# EAGLE design full_adder (EAGLE 6.5.0)
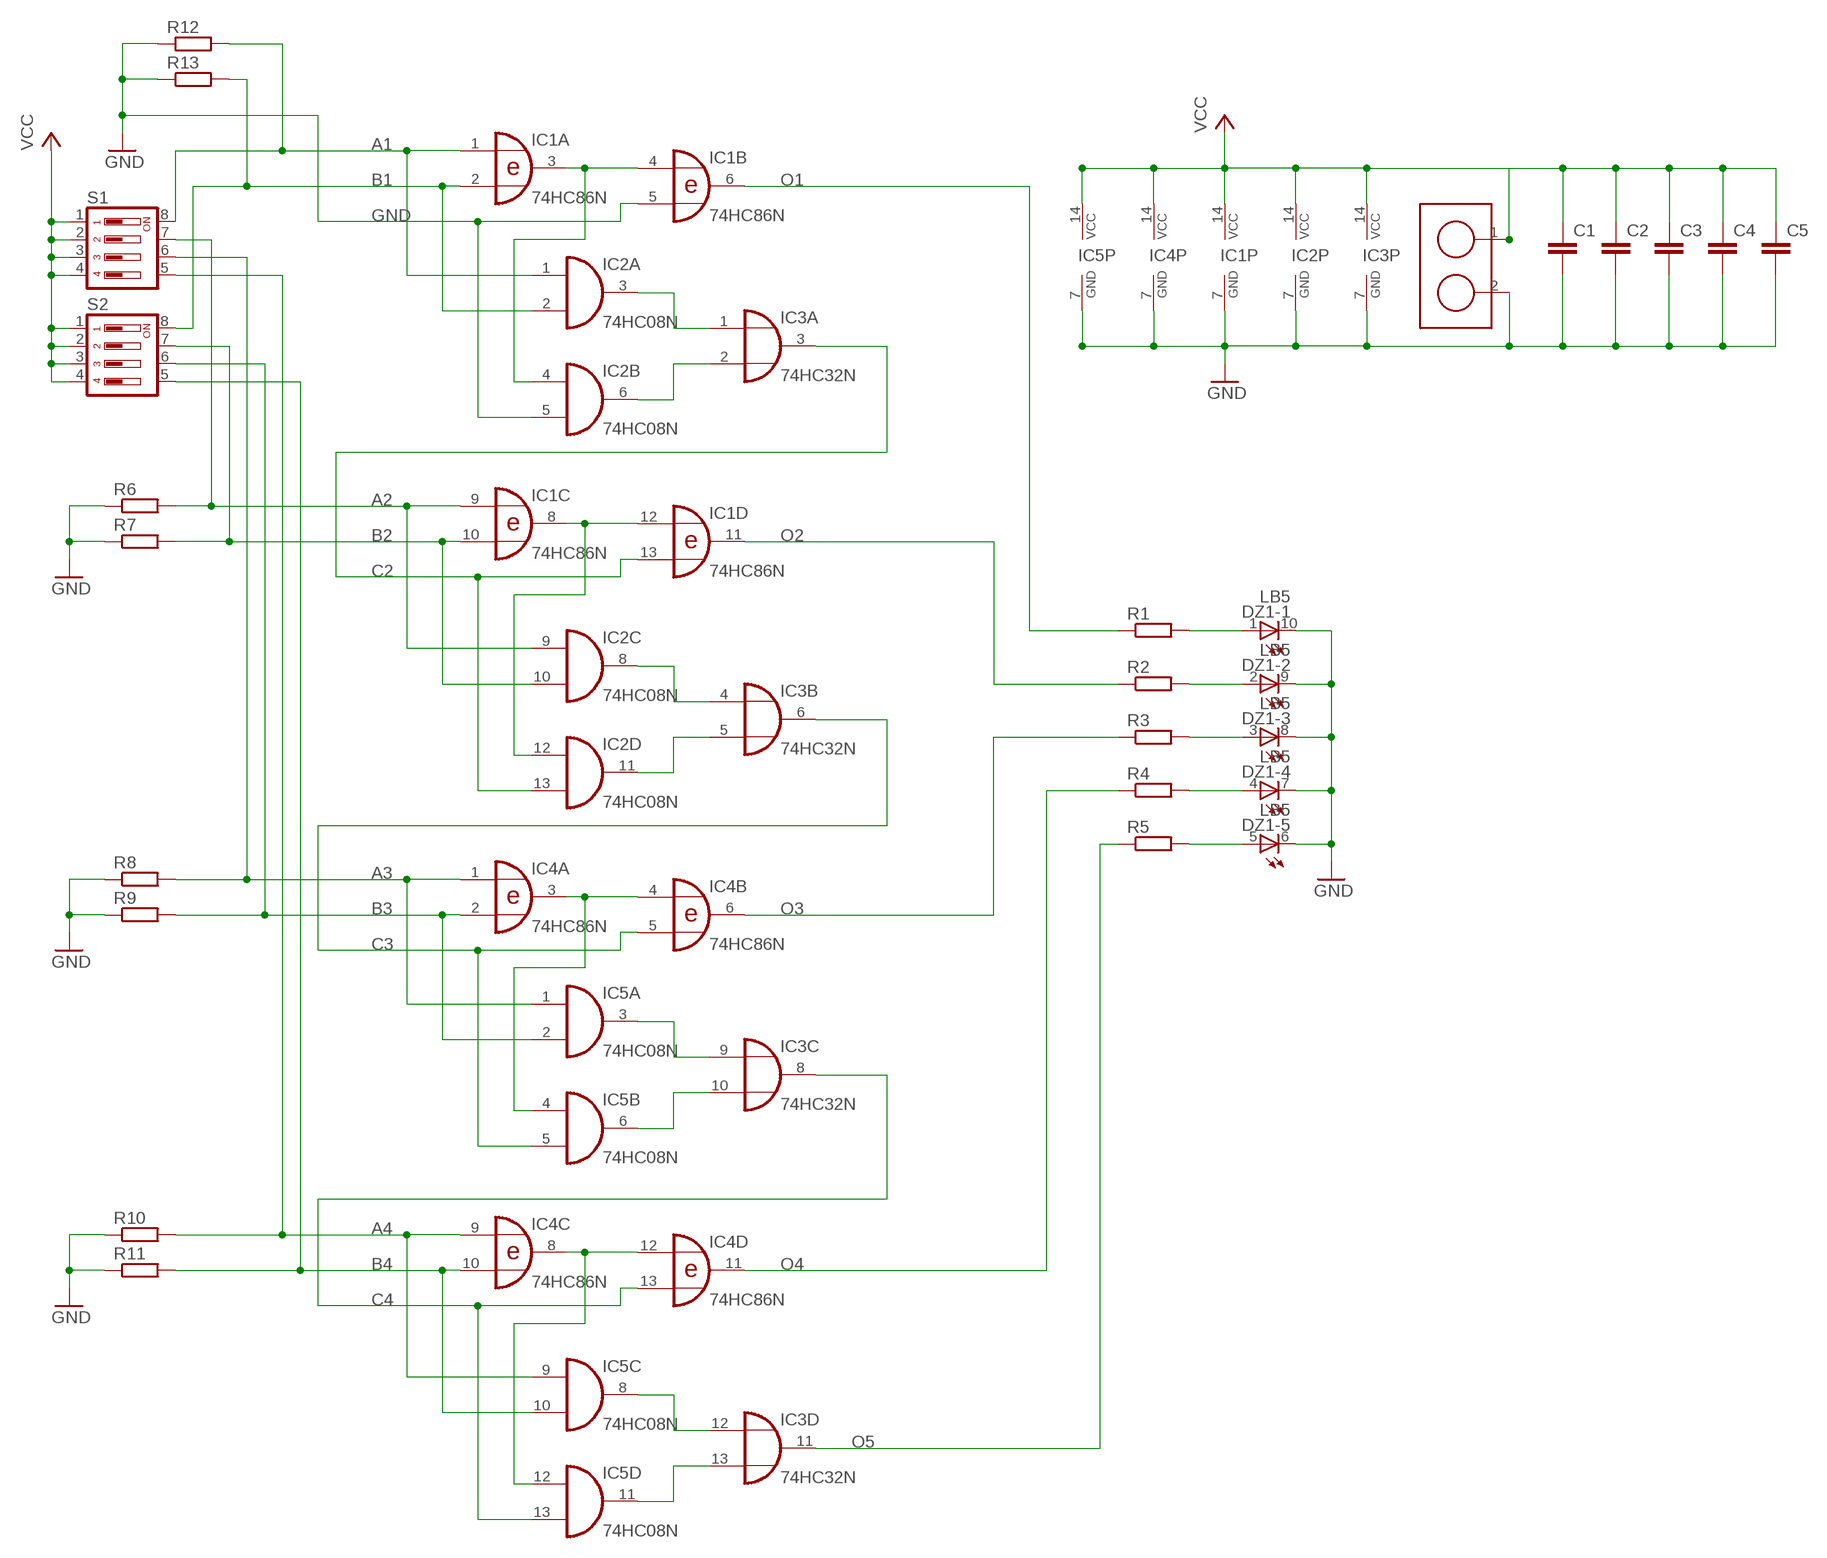
[diagram p0: schematic, sheet 1]

## Parts
C1  C-EU025-025X050  [C025-025X050]
C2  C-EU025-025X050  [C025-025X050]
C3  C-EU025-025X050  [C025-025X050]
C4  C-EU025-025X050  [C025-025X050]
C5  C-EU025-025X050  [C025-025X050]
DZ1  LB5  [LB5]
IC1  74HC86N  [DIL14]
IC2  74HC08N  [DIL14]
IC3  74HC32N  [DIL14]
IC4  74HC86N  [DIL14]
IC5  74HC08N  [DIL14]
R1  R-EU_0204/7  [0204/7]
R2  R-EU_0204/7  [0204/7]
R3  R-EU_0204/7  [0204/7]
R4  R-EU_0204/7  [0204/7]
R5  R-EU_0204/7  [0204/7]
R6  10K  R-EU_0204/7  [0204/7]
R7  10K  R-EU_0204/7  [0204/7]
R8  10K  R-EU_0204/7  [0204/7]
R9  10K  R-EU_0204/7  [0204/7]
R10  10K  R-EU_0204/7  [0204/7]
R11  10K  R-EU_0204/7  [0204/7]
R12  10K  R-EU_0204/7  [0204/7]
R13  10K  R-EU_0204/7  [0204/7]
S1  DS04  [DS-04]
S2  DS04  [DS-04]
U$5  TB2  [TB2]

## Nets
A1: IC1.1(A:I0) IC2.1(A:I0) R12.2 S1.8
A2: IC1.9(C:I0) IC2.9(C:I0) R6.2 S1.7
A3: IC4.1(A:I0) IC5.1(A:I0) R8.2 S1.6
A4: IC4.9(C:I0) IC5.9(C:I0) R10.2 S1.5
B1: IC1.2(A:I1) IC2.2(A:I1) R13.2 S2.8
B2: IC1.10(C:I1) IC2.10(C:I1) R7.2 S2.7
B3: IC4.2(A:I1) IC5.2(A:I1) R9.2 S2.6
B4: IC4.10(C:I1) IC5.10(C:I1) R11.2 S2.5
C2: IC1.13(D:I1) IC2.13(D:I1) IC3.3(A:O)
C3: IC3.6(B:O) IC4.5(B:I1) IC5.5(B:I1)
C4: IC3.8(C:O) IC4.13(D:I1) IC5.13(D:I1)
GND: C1.2 C2.2 C3.2 C4.2 C5.2 DZ1.6(-5:C) DZ1.7(-4:C) DZ1.8(-3:C) DZ1.9(-2:C) DZ1.10(-1:C) IC1.5(B:I1) IC1.7(P:GND) IC2.5(B:I1) IC2.7(P:GND) IC3.7(P:GND) IC4.7(P:GND) IC5.7(P:GND) R6.1 R7.1 R8.1 R9.1 R10.1 R11.1 R12.1 R13.1 U$5.2
N$1: IC1.8(C:O) IC1.12(D:I0) IC2.12(D:I0)
N$2: IC1.3(A:O) IC1.4(B:I0) IC2.4(B:I0)
N$3: IC4.8(C:O) IC4.12(D:I0) IC5.12(D:I0)
N$4: IC4.3(A:O) IC4.4(B:I0) IC5.4(B:I0)
N$5: IC2.3(A:O) IC3.1(A:I0)
N$6: IC2.6(B:O) IC3.2(A:I1)
N$7: IC3.9(C:I0) IC5.3(A:O)
N$8: IC2.8(C:O) IC3.4(B:I0)
N$9: IC2.11(D:O) IC3.5(B:I1)
N$10: IC3.10(C:I1) IC5.6(B:O)
N$11: DZ1.1(-1:A) R1.2
N$12: IC3.12(D:I0) IC5.8(C:O)
N$13: IC3.13(D:I1) IC5.11(D:O)
N$14: DZ1.2(-2:A) R2.2
N$15: DZ1.3(-3:A) R3.2
N$16: DZ1.4(-4:A) R4.2
N$17: DZ1.5(-5:A) R5.2
O1: IC1.6(B:O) R1.1
O2: IC1.11(D:O) R2.1
O3: IC4.6(B:O) R3.1
O4: IC4.11(D:O) R4.1
O5: IC3.11(D:O) R5.1
VCC: C1.1 C2.1 C3.1 C4.1 C5.1 IC1.14(P:VCC) IC2.14(P:VCC) IC3.14(P:VCC) IC4.14(P:VCC) IC5.14(P:VCC) S1.1 S1.2 S1.3 S1.4 S2.1 S2.2 S2.3 S2.4 U$5.1

## Library data of the parts
C1-C5 = rcl:C-EU: CAPACITOR, European symbol
DZ1 = thierry_eagle:LB5: LED BLOCK 5-LED bar graph, DIL, Siemens
IC1 IC4 = 74xx-eu:74*86: Quad 2-input EXCLUSIVE-OR (XOR) gate
IC2 IC5 = 74xx-eu:74*08: Quad 2-input AND gate
IC3 = 74xx-eu:74*32: Quad 2-input OR gate
R1-R13 = rcl:R-EU_: RESISTOR, European symbol
S1 S2 = switch-dil:DS04: DIL/CODE SWITCH; OC_FARNELL: 9471570; OC_NEWARK: unknown
U$5 = MY_CONN:TB2

## Board
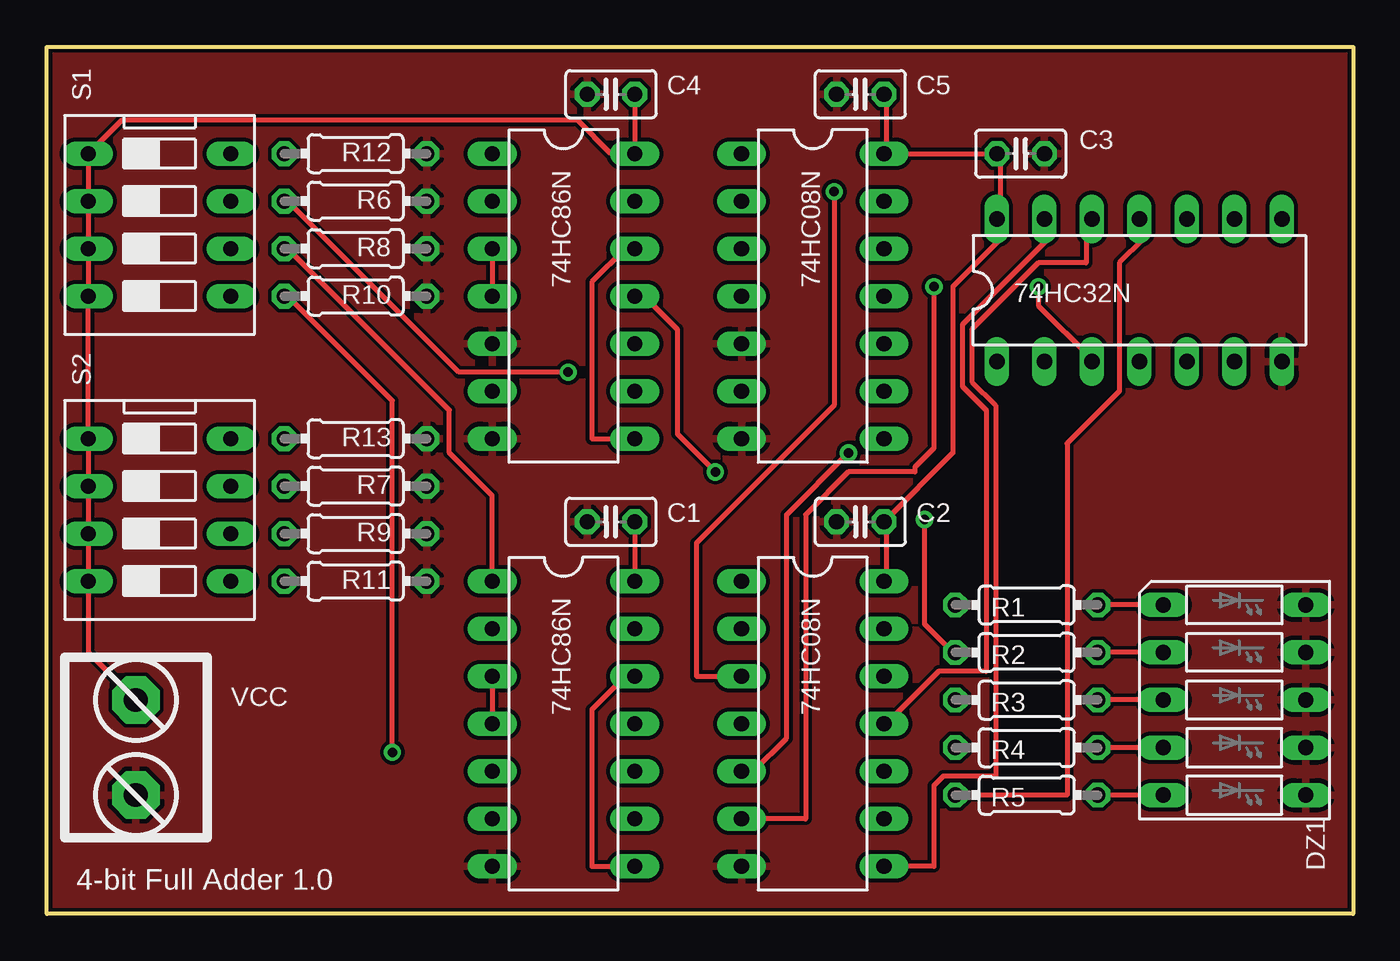
[diagram p1: board, top side]
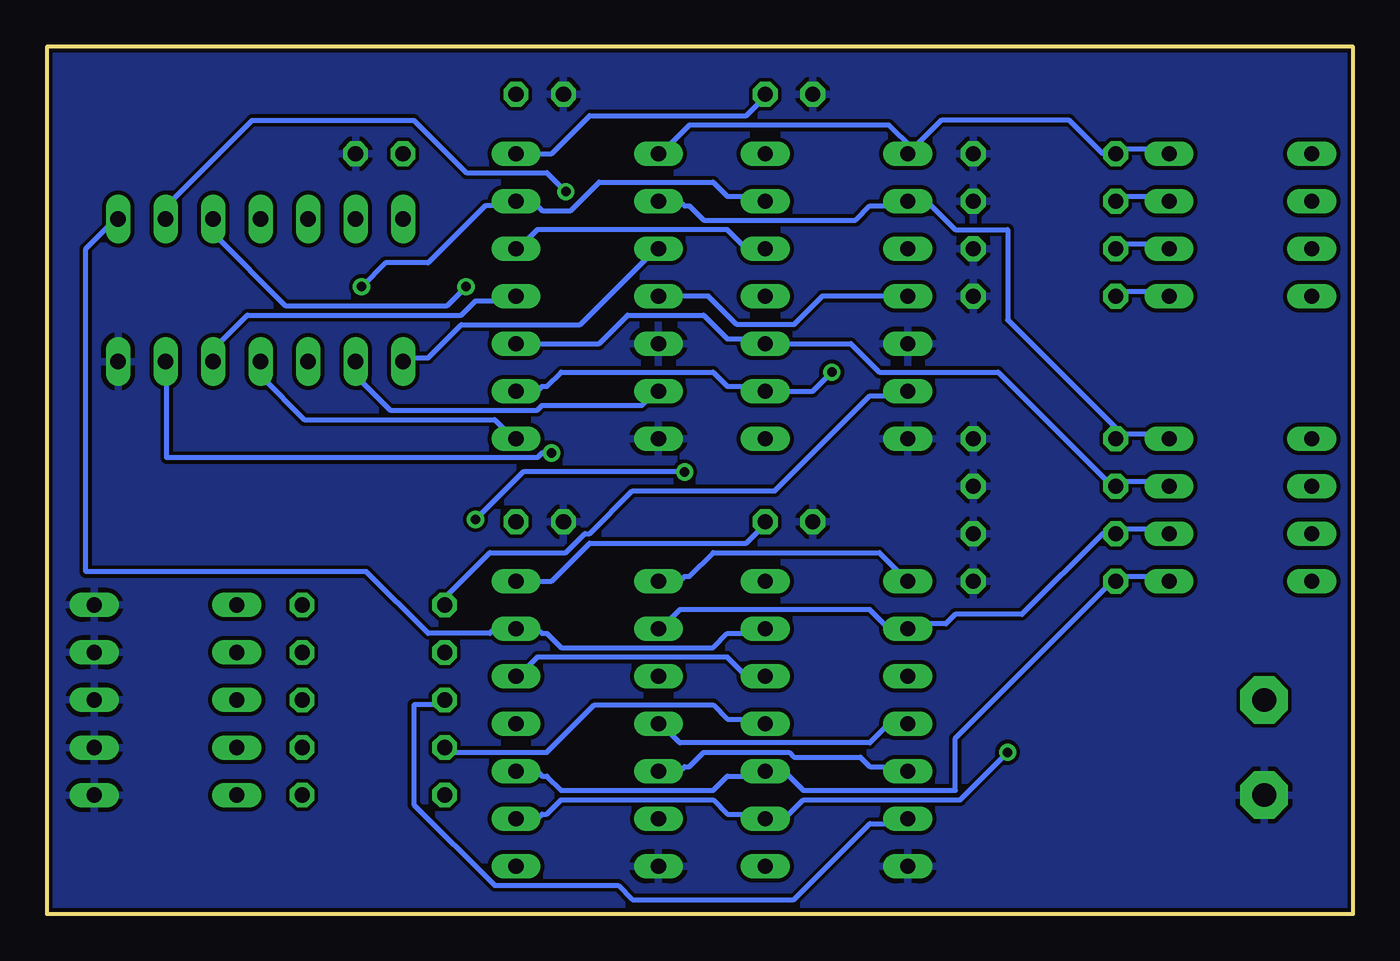
[diagram p2: board, bottom side, seen from below]

Size 69.85 x 46.35 mm. Coordinates in mm from the lower left corner, seen from the top.
Outline: 0,0 0,46.35 69.85,46.35 69.85,0 0,0
Copper layers (1*16): Top 0.035mm / dielectric 1.5mm / Bottom 0.035mm
Design rules "default *": minimum track width 10mil, minimum drill 20mil, track to track 8mil, track to pad 8mil, pad to pad 8mil, via to via 8mil, smd to smd 8mil, copper to edge 8mil, drill to drill 8mil, minimum pad ring 10mil, minimum via ring 8mil, stop-mask expansion 4mil, vias tented up to drill 0mil, thermal gap 10mil

### Footprints (pad centres in the part's own frame; a part is rotated, then mirrored left to right if it is on the bottom)
C025-025X050 = drill 0.813 octagon: 1 -1.27,0; 2 1.27,0
LB5 = drill 0.813 long: 1 -5.08,-3.81; 2 -2.54,-3.81; 3 0,-3.81; 4 2.54,-3.81; 5 5.08,-3.81; 6 5.08,3.81; 7 2.54,3.81; 8 0,3.81; 9 -2.54,3.81; 10 -5.08,3.81
DIL14 = drill 0.813 long: 1 -7.62,-3.81; 2 -5.08,-3.81; 3 -2.54,-3.81; 4 0,-3.81; 5 2.54,-3.81; 6 5.08,-3.81; 7 7.62,-3.81; 8 7.62,3.81; 9 5.08,3.81; 10 2.54,3.81; 11 0,3.81; 12 -2.54,3.81; 13 -5.08,3.81; 14 -7.62,3.81
0204/7 = drill 0.813 octagon: 1 -3.81,0; 2 3.81,0
DS-04 = drill 0.813 long: 1 -3.81,-3.81; 2 -1.27,-3.81; 3 1.27,-3.81; 4 3.81,-3.81; 5 3.81,3.81; 6 1.27,3.81; 7 -1.27,3.81; 8 -3.81,3.81
TB2 = drill 1.27 pad 2.54 octagon: 1 0,0; 2 5.08,0

### Placement (x,y rotation side)
C1  30.16,20.95 180 top
C2  43.5,20.95 180 top
C3  52.07,40.64 0 top
C4  30.16,43.81 180 top
C5  43.5,43.81 180 top
DZ1  63.5,11.43 270 top
IC1  27.62,33.02 270 top
IC2  40.96,33.02 270 top
IC3  58.42,33.34 0 top
IC4  27.62,10.16 270 top
IC5  40.96,10.16 270 top
R1  52.39,16.51 0 top
R2  52.39,13.97 0 top
R3  52.39,11.43 0 top
R4  52.39,8.89 0 top
R5  52.39,6.35 0 top
R6  16.51,38.1 180 top
R7  16.51,22.86 180 top
R8  16.51,35.56 180 top
R9  16.51,20.32 180 top
R10  16.51,33.02 180 top
R11  16.51,17.78 180 top
R12  16.51,40.64 180 top
R13  16.51,25.4 180 top
S1  6.03,36.83 270 top
S2  6.03,21.59 270 top
U$5  4.76,11.43 270 top

### Tracks (layer width: path | path; a pad name or v marks a point on that pad's centre or on a via)
A1
  Bottom 0.254: S1.8 10.1,40.89 12.38,40.89 12.64,40.64 R12.2 13.4,40.64 15.18,42.42 22.03,42.42 23.56,40.89 | 23.56,40.89 24.83,42.16 35.5,42.16 37.02,40.64 IC2.1 | 23.56,40.89 IC1.1
A2  (via drill 0.51)
  Top 0.254: v27.88,28.96 22.03,28.96 12.89,38.1 R6.2
  Bottom 0.254: S1.7 10.1,38.35 12.38,38.35 12.64,38.1 R6.2 | IC2.9 43.62,27.94 43.37,28.19 43.12,28.19 42.35,28.96 34.23,28.96 33.46,28.19 31.69,28.19 IC1.9 28.89,27.94 v27.88,28.96
A3
  Top 0.254: IC4.1 23.81,22.35 21.53,24.64 21.53,26.92 12.89,35.56 R8.2
  Bottom 0.254: S1.6 10.1,35.81 12.38,35.81 12.64,35.56 R8.2 | IC4.1 25.34,19.3 34.23,19.3 35.5,18.03 35.75,18.03 36,17.78 IC5.1
A4  (via drill 0.51)
  Top 0.254: v18.48,8.64 18.48,27.43 12.89,33.02 R10.2
  Bottom 0.254: S1.5 10.1,33.27 12.38,33.27 12.64,33.02 R10.2 | IC5.9 43.62,5.08 43.37,5.33 43.12,5.33 42.35,6.1 34.23,6.1 33.46,5.33 31.69,5.33 IC4.9 30.42,5.08 29.4,6.1 21.02,6.1 v18.48,8.64
B1
  Bottom 0.254: S2.8 10.1,25.65 12.38,25.65 | 12.38,25.65 12.64,25.4 R13.2 12.38,25.65 | IC2.2 36,38.1 35.75,37.85 35.5,37.85 34.73,37.08 26.61,37.08 25.84,37.85 24.07,37.85 IC1.2 22.8,38.1 21.27,36.58 18.48,36.58 18.48,31.75 12.38,25.65
B2
  Bottom 0.254: S2.7 10.1,23.11 12.38,23.11 12.64,22.86 R7.2 12.89,22.86 18.99,28.96 25.34,28.96 26.86,30.48 IC1.10 31.69,30.73 33.46,30.73 34.73,32 38.8,32 40.32,30.48 IC2.10
B3
  Bottom 0.254: IC5.2 37.02,15.24 36,16.26 25.84,16.26 24.83,15.24 IC4.2 23.56,15.49 21.78,15.49 21.27,16 17.72,16 13.4,20.32 R9.2 12.64,20.32 12.38,20.57 10.1,20.57 S2.6
B4
  Bottom 0.254: S2.5 10.1,18.03 12.38,18.03 12.64,17.78 R11.2 12.89,17.78 21.27,9.4 21.27,6.6 29.4,6.6 30.42,7.62 IC4.10 31.69,7.37 33.46,7.37 34.23,6.6 42.35,6.6 43.12,7.37 43.37,7.37 43.62,7.62 IC5.10
C2  (via drill 0.51)
  Top 0.254: v53.02,33.53 53.02,32.51 55.82,29.72 IC3.3
  Bottom 0.254: IC1.13 31.69,38.35 33.46,38.35 34.23,39.12 40.32,39.12 41.85,37.59 43.37,37.59 43.62,37.85 | 43.62,37.85 43.88,38.1 IC2.13 43.62,37.85 | v53.02,33.53 51.75,34.8 49.47,34.8 46.42,37.85 43.62,37.85
C3  (via drill 0.51)
  Top 0.254: v42.86,24.64 39.56,21.34 39.56,9.4 37.78,7.62 IC5.5
  Bottom 0.254: IC4.5 24.07,7.87 25.84,7.87 26.35,8.38 29.91,8.38 30.16,8.64 34.73,8.64 35.5,7.87 35.75,7.87 36,7.62 IC5.5 | v42.86,24.64 43.37,24.64 43.62,24.38 63.44,24.38 63.44,29.46 IC3.6
C4
  Bottom 0.254: IC4.13 31.69,14.99 33.46,14.99 34.23,14.22 42.35,14.22 43.12,14.99 43.37,14.99 43.62,15.24 IC5.13 45.91,15.24 46.16,14.99 49.47,14.99 52.77,18.29 67.75,18.29 67.75,35.56 66.23,37.08 IC3.8
GND
  pour Top: -0.32,-0.32 -0.32,46.67 70.17,46.67 70.17,-0.32
  pour Bottom: -0.32,-0.32 -0.32,46.67 70.17,46.35 70.17,-0.32
N$1
  Top 0.254: IC1.8 29.15,25.4 29.15,33.78 30.92,35.56 IC1.12
  Bottom 0.254: IC1.12 32.45,35.56 33.46,36.58 43.62,36.58 44.64,35.56 IC2.12
N$2
  Top 0.254: IC1.3 IC1.4
  Bottom 0.254: IC2.4 34.48,33.02 32.96,31.5 29.91,31.5 28.38,33.02 IC1.4
N$3
  Top 0.254: IC4.8 29.15,2.54 29.15,10.92 30.92,12.7 IC4.12
  Bottom 0.254: IC4.12 32.45,12.7 33.46,13.72 43.62,13.72 44.64,12.7 IC5.12
N$4
  Top 0.254: IC4.3 IC4.4
  Bottom 0.254: IC4.4 24.83,10.16 25.84,9.14 36,9.14 37.02,10.16 IC5.4
N$5
  Bottom 0.254: IC2.3 37.27,35.56 41.34,31.5 47.69,31.5 49.47,29.72 50.74,29.72 IC3.1
N$6
  Bottom 0.254: IC2.6 37.27,27.94 38.04,27.18 43.37,27.18 43.62,26.92 51.5,26.92 53.28,28.7 53.28,29.46 IC3.2
N$7  (via drill 0.51)
  Top 0.254: IC5.3 34.73,12.7 34.73,19.81 42.1,27.18 v42.1,38.61
  Bottom 0.254: v42.1,38.61 43.12,39.62 47.43,39.62 50.23,42.42 58.86,42.42 63.44,37.85 63.44,37.34 IC3.9
N$8
  Bottom 0.254: IC2.8 44.89,25.4 45.91,26.42 56.07,26.42 58.36,28.7 58.36,29.46 IC3.4
N$9
  Bottom 0.254: IC2.11 44.89,33.02 45.15,32.77 46.93,32.77 47.69,32 59.12,32 60.9,30.23 60.9,29.72 IC3.5
N$10  (via drill 0.51)
  Top 0.254: IC5.6 40.58,5.08 40.58,21.34 42.86,23.62 46.42,23.62 46.42,23.88 47.43,24.89 v47.43,33.53
  Bottom 0.254: v47.43,33.53 48.45,32.51 57.09,32.51 60.9,36.32 60.9,37.08 IC3.10
N$11
  Top 0.254: DZ1.1 R1.2
N$12
  Top 0.254: IC5.8 47.43,2.54 47.43,6.86 47.94,7.37 50.74,7.37 50.74,27.18 49.47,28.45 49.47,31.24 53.02,34.8 55.56,34.8 55.56,36.83 IC3.12
N$13
  Top 0.254: IC5.11 44.89,10.16 47.69,12.95 50.23,12.95 50.23,26.92 48.96,28.19 48.96,31.5 53.53,36.07 53.53,37.08 IC3.13
N$14
  Top 0.254: DZ1.2 R2.2
N$15
  Top 0.254: DZ1.3 R3.2
N$16
  Top 0.254: DZ1.4 R4.2
N$17
  Top 0.254: DZ1.5 R5.2
O1
  Bottom 0.254: IC1.6 24.07,27.69 25.84,27.69 30.92,22.61 38.54,22.61 40.83,20.32 41.08,20.32 42.1,19.3 46.16,19.3 48.45,17.02 48.45,16.51 R1.1
O2  (via drill 0.51)
  Top 0.254: v46.93,21.08 46.93,15.49 48.45,13.97 R2.1 | v35.75,23.62 33.72,25.65 33.72,31.24 31.94,33.02 IC1.11
  Bottom 0.254: v46.93,21.08 44.39,23.62 v35.75,23.62
O3
  Bottom 0.254: IC4.6 24.07,4.83 25.84,4.83 29.91,0.76 38.54,0.76 39.31,1.52 45.91,1.52 50.23,5.84 50.23,11.18 48.96,11.18 48.7,11.43 R3.1
O4
  Bottom 0.254: IC4.11 31.69,10.41 33.46,10.41 34.23,11.18 40.58,11.18 43.12,8.64 48.2,8.64 48.45,8.89 R4.1
O5
  Top 0.254: R5.1 54.55,6.35 54.55,25.15 57.34,27.94 57.34,34.8 58.61,36.07 58.61,37.08 IC3.11
VCC
  Top 0.254: U$5.1 2.22,13.97 S2.4 S2.3 S2.2 S2.1 S1.4 S1.3 S1.2 S1.1 4,42.42 28.38,42.42 30.16,40.64 IC1.14 C4.1 | C1.1 IC4.14 | IC5.14 44.89,17.78 44.89,20.83 C2.1 48.45,24.64 48.45,33.53 50.99,36.07 50.99,37.08 IC3.14 50.99,37.34 50.99,40.64 C3.1 44.89,40.64 | 44.89,40.64 44.89,43.69 C5.1 | 44.89,40.64 IC2.14
  Bottom 0.254: IC5.14 42.86,17.78 40.83,19.81 32.45,19.81 31.43,20.83 C1.1 | IC2.14 42.86,40.64 40.83,42.67 32.45,42.67 31.43,43.69 C4.1

### Text on the board
tNames: VCC | 4-bit Full Adder 1.0